# Altium schematic sheet C0603C101J5HACAUTO.SchDoc
size A; SheetNumber: 1; SheetTotal: 1
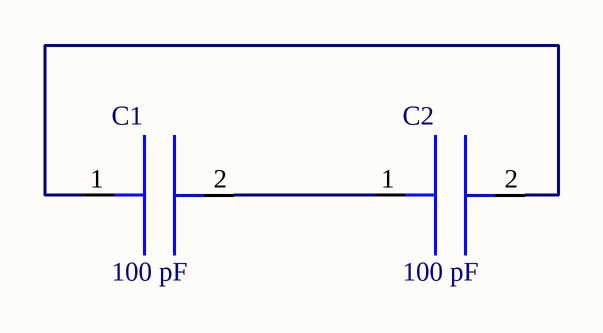
[diagram p0: C0603C101J5HACAUTO.SchDoc]

## Parts
C1  100 pF  [C0603C101J5HACAUTO]
C2  100 pF  [C0603C101J5HACAUTO]

## Nets
NetC1_1: C1.1 C2.2
NetC1_2: C1.2 C2.1

## Library data of the parts
C1 C2 = C0603C101J5HACAUTO: Capacitor Cerámico SMD 0603, 50V, +/-5%, C0G